# Altium project forwardConverterPCB.PrjPcb (part 6 of 22)
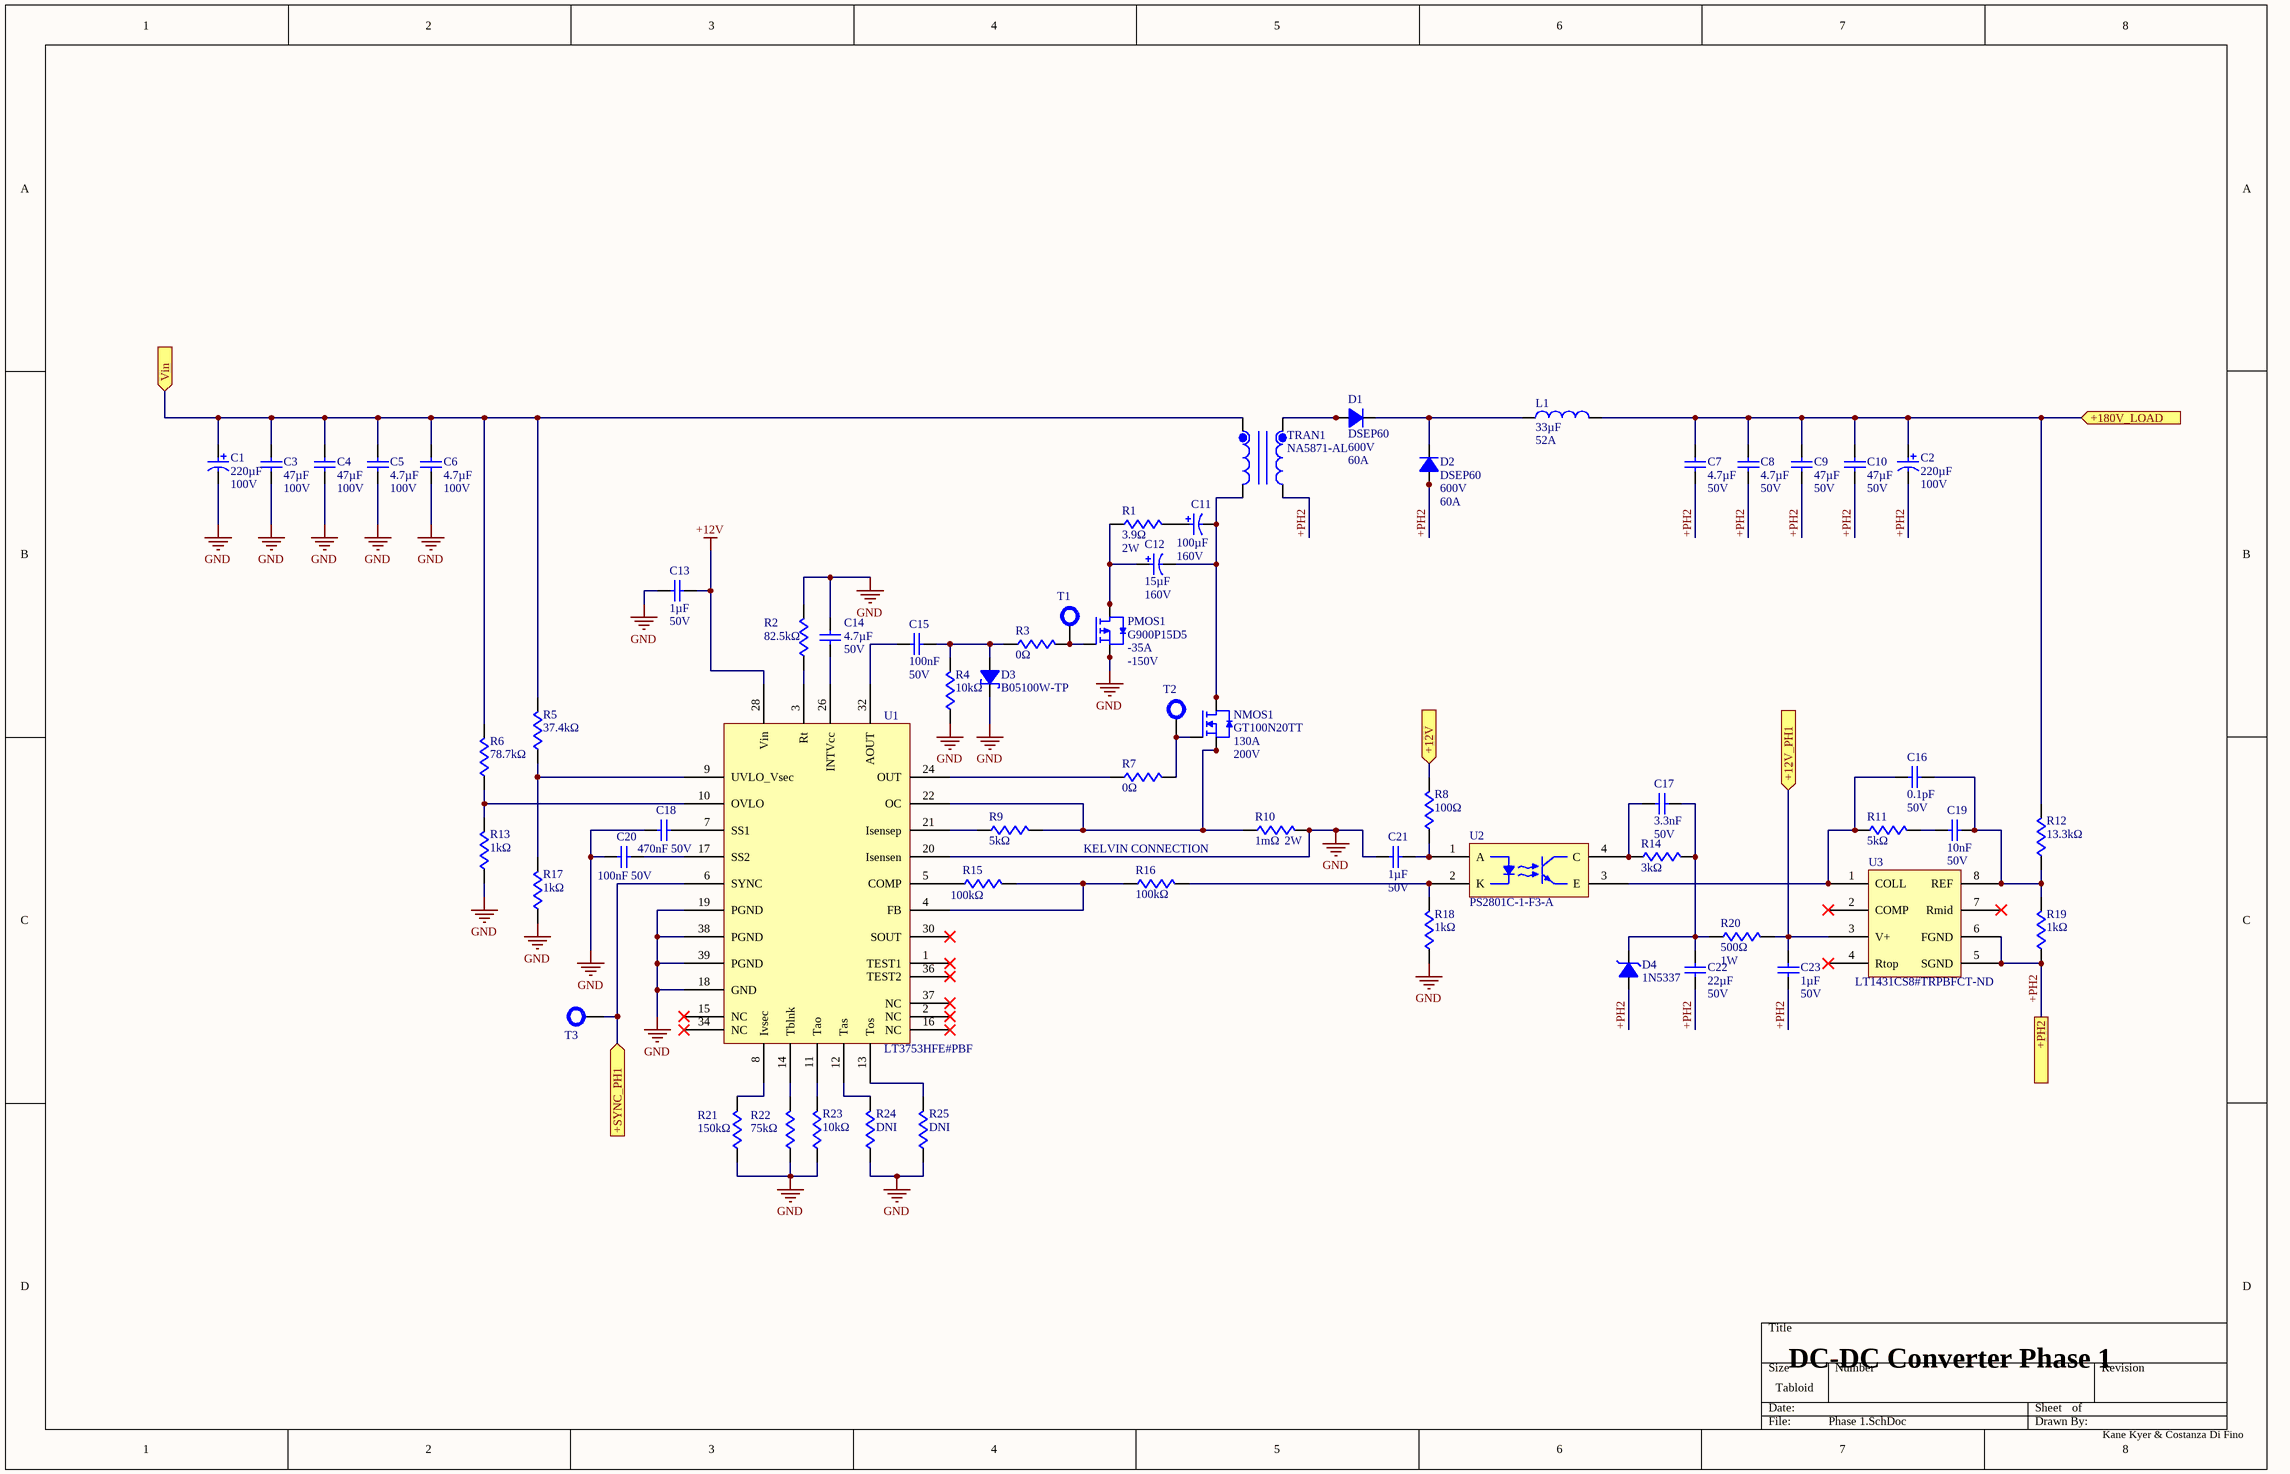
[diagram p11: Phase 1.SchDoc]

## Sheet Phase 1.SchDoc (continued)

### Library data of the parts (continued)
U2 = PS2801C-1-F3-A: Optocoupler DC-IN 1-CH Transistor DC-OUT 4-Pin SSOP T/R; Manufacturer: Renesas; Manufacturer Lifecycle Status: ACTIVE; Collector Emitter Breakdown Voltage: 80V; Collector Emitter Saturation Voltage: 300mV; Current Transfer Ratio: 50%; Dark Current: 100nA; Forward Current: 30mA; Forward Voltage: 1.4V; Input Current: 5mA; Isolation Voltage: 2.5kV; Max Power Dissipation: 120mW; Number of Elements: 1; Reverse Breakdown Voltage: 6V; Target Application: PLC\, Hybrid IC\, Power supply\, OA\, Measuring instrument\, Modem\, Communication devices; Supplier: DigiKey; RoHS: Compliant; Category: Optocouplers; Stock: 8089; Pricing: 1=0.85, 10=0.594, 100=0.436, 500=0.3653, 1000=0.34213 (USD); Case/Package: SSOP; China RoHS: Compliant; Collector Emitter Voltage (VCEO): 80V; Contact Plating: Tin Bismuth; Export Control Classification Number (ECCN) Code: EAR99; Part Family: PS2801C-1; Height: 2.1mm; Harmonized Tariff Schedule (HTS) Code: 8541.49.8000; Lifecycle Status: Production; Max Operating Temperature: 100°C; Min Operating Temperature: -55°C; MSL: 1; Mounting Technology: Surface Mount; Pins: 4; Output Voltage: 80V; Packaging: Cut Tape; REACH SVHC: Yes; ComponentLink1URL: https://datasheet.octopart.com:443/PS2801C-1-F3-A-Renesas-datasheet-179197394.pdf?src-supplier=Integrated+Device+Technology; ComponentLink1Description: https://datasheet.octopart.com:443/PS2801C-1-F3-A-Renesas-datasheet-179197394.pdf?src-supplier=Integrated+Device+Technology; ComponentLink2URL: https://datasheet.octopart.com:443/PS2801C-1-F3-A-Renesas-datasheet-150850810.pdf?src-supplier=Integrated+Device+Technology; ComponentLink2Description: https://datasheet.octopart.com:443/PS2801C-1-F3-A-Renesas-datasheet-150850810.pdf?src-supplier=Integrated+Device+Technology; ComponentLink3URL: https://datasheet.octopart.com:443/PS2801C-1-F3-A-Integrated-Device-Technology-datasheet-149188203.pdf?src-supplier=Integrated+Device+Technology; ComponentLink3Description: https://datasheet.octopart.com:443/PS2801C-1-F3-A-Integrated-Device-Technology-datasheet-149188203.pdf?src-supplier=Integrated+Device+Technology; ComponentLink4URL: https://datasheet.octopart.com:443/PS2801C-1-F3-A-Renesas-datasheet-181196928.pdf?src-supplier=IHS; ComponentLink4Description: https://datasheet.octopart.com:443/PS2801C-1-F3-A-Renesas-datasheet-181196928.pdf?src-supplier=IHS; ComponentLink5URL: https://datasheet.octopart.com:443/PS2801C-1-F3-A-NEC-datasheet-180895691.pdf?src-supplier=IHS; ComponentLink5Description: https://datasheet.octopart.com:443/PS2801C-1-F3-A-NEC-datasheet-180895691.pdf?src-supplier=IHS; ComponentLink6URL: https://datasheet.octopart.com:443/PS2801C-1-F3-A-Renesas-datasheet-138175760.pdf?src-supplier=Renesas; ComponentLink6Description: https://datasheet.octopart.com:443/PS2801C-1-F3-A-Renesas-datasheet-138175760.pdf?src-supplier=Renesas; ComponentLink7URL: https://datasheet.octopart.com:443/PS2801C-1-F3-A-Renesas-datasheet-5346041.pdf?src-supplier=element14+APAC; ComponentLink7Description: https://datasheet.octopart.com:443/PS2801C-1-F3-A-Renesas-datasheet-5346041.pdf?src-supplier=element14+APAC; ComponentLink8URL: https://datasheet.octopart.com:443/PS2801C-1-F3-A-Renesas-datasheet-136880012.pdf?src-supplier=Future+Electronics; ComponentLink8Description: https://datasheet.octopart.com:443/PS2801C-1-F3-A-Renesas-datasheet-136880012.pdf?src-supplier=Future+Electronics; ComponentLink9URL: http://sigma.octopart.com:80/reach_statement/Renesas-company-45.pdf?src-supplier=Compliance+Statements; ComponentLink9Description: http://sigma.octopart.com:80/reach_statement/Renesas-company-45.pdf?src-supplier=Compliance+Statements; ComponentLink10URL: http://sigma.octopart.com:80/conflict_mineral_statement/Renesas-company-44.pdf?src-supplier=Compliance+Statements; ComponentLink10Description: http://sigma.octopart.com:80/conflict_mineral_statement/Renesas-company-44.pdf?src-supplier=Compliance+Statements; Supplier Part Number: 559-1038-1-ND; Manufacturer Part Number: PS2801C-1-F3-A
U3 = LT1431CS8#TRPBF: V-Ref Adjustable 2.5V to 36V 100mA 8-Pin SOIC N T/R; Manufacturer: Analog Devices; Manufacturer Lifecycle Status: PRODUCTION; Cathode Current: 1mA; Reference Type: Shunt; Temperature Coefficient: 30ppm/°C; Tolerance: 0.4%; Supplier: DigiKey; Manufacturer Part Number: LT1431CS8#TRPBF; RoHS: Compliant; Category: Voltage References; Stock: 6692; Pricing: 1=4.76, 10=3.623, 25=3.3384, 100=3.025, 250=2.9682 (USD); Lead Free: Lead Free; Lifecycle Status: Production; Max Operating Temperature: 70°C; Max Output Voltage: 36V; Min Operating Temperature: 0°C; Min Output Voltage: 2.5V; Mounting Technology: Surface Mount; Pins: 8; Output Current: 100mA; Output Type: Adjustable; ComponentLink1URL: https://octopart.com:443/opatz8j6/c1?t=niELlFxzDfi0yCwovPYUCPkFv5h4fu5j3fc6Y_JWgZS-KG3gguwV1nhos1IG-X0q8FOT95_5suT6z4bIqEEHZa5Cr0Tl4wX-4Gea3le2l_P5Btni36aNB0VKN1eACfVw6XjlixpjNPZ2EoCnIZsmdjVtLb4T5dOKJqdmaG9p1s8rLUbRPnop80aw4yYD8dobzP2rtKjoPZxkMFX7s_x1MbrDISVlTufhy0OqU5fodmlGcRlmdB2uK6Q8wi9wAMnylkp3u30aJUXp9y1pTV4VT8brQ8AQsJucKiRghXvlz7QI_mNVRP68og&src-supplier=Analog+Devices; ComponentLink1Description: https://octopart.com:443/opatz8j6/c1?t=niELlFxzDfi0yCwovPYUCPkFv5h4fu5j3fc6Y_JWgZS-KG3gguwV1nhos1IG-X0q8FOT95_5suT6z4bIqEEHZa5Cr0Tl4wX-4Gea3le2l_P5Btni36aNB0VKN1eACfVw6XjlixpjNPZ2EoCnIZsmdjVtLb4T5dOKJqdmaG9p1s8rLUbRPnop80aw4yYD8dobzP2rtKjoPZxkMFX7s_x1MbrDISVlTufhy0OqU5fodmlGcRlmdB2uK6Q8wi9wAMnylkp3u30aJUXp9y1pTV4VT8brQ8AQsJucKiRghXvlz7QI_mNVRP68og&src-supplier=Analog+Devices; ComponentLink2URL: https://datasheet.octopart.com:443/LT1431CS8%23TRPBF-Analog-Devices-datasheet-158590489.pdf?src-supplier=Augswan; ComponentLink2Description: https://datasheet.octopart.com:443/LT1431CS8%23TRPBF-Analog-Devices-datasheet-158590489.pdf?src-supplier=Augswan; ComponentLink3URL: https://sigma.octopart.com:443/57689574/technical_drawing/Linear-Technology-LT1431CS8%23TRPBF.pdf?src-supplier=Linear+Technology; ComponentLink3Description: https://sigma.octopart.com:443/57689574/technical_drawing/Linear-Technology-LT1431CS8%23TRPBF.pdf?src-supplier=Linear+Technology; ComponentLink4URL: https://datasheet.octopart.com:443/LT1431CS8%23TRPBF-Linear-Technology-datasheet-12663249.pdf?src-supplier=Linear+Technology; ComponentLink4Description: https://datasheet.octopart.com:443/LT1431CS8%23TRPBF-Linear-Technology-datasheet-12663249.pdf?src-supplier=Linear+Technology; ComponentLink5URL: https://datasheet.octopart.com:443/LT1431CS8%23TRPBF-Linear-Technology-datasheet-14162000.pdf?src-supplier=iiiC; ComponentLink5Description: https://datasheet.octopart.com:443/LT1431CS8%23TRPBF-Linear-Technology-datasheet-14162000.pdf?src-supplier=iiiC; ComponentLink6URL: https://datasheet.octopart.com:443/LT1431CS8%23TRPBF-Linear-Technology-datasheet-660441.pdf?src-supplier=Component+Distributors+Inc.; ComponentLink6Description: https://datasheet.octopart.com:443/LT1431CS8%23TRPBF-Linear-Technology-datasheet-660441.pdf?src-supplier=Component+Distributors+Inc.; ComponentLink7URL: http://sigma.octopart.com:80/conflict_mineral_statement/Analog-Devices-company-33.pdf?src-supplier=Compliance+Statements; ComponentLink7Description: http://sigma.octopart.com:80/conflict_mineral_statement/Analog-Devices-company-33.pdf?src-supplier=Compliance+Statements; ComponentLink8URL: https://octopart.com:443/opatz8j6/c1?t=x_UgC8z0ZW9HVBYfWtRK1MQXyidqPpcSjAfueHo9YnawvAkFl5SvDyGxYSqo2jvWZKzVJDVTRvwyt6-9bSOmk9hm3rvBRrSJoViBsOBz-zaTqDQ1UuTon1oynDbAG1BJ8LFFGJ-pvHqqe_ahwIPaiUAyxwKDpl_WDXhLfkPwU4s3DC4oM42DqSA56VDCGnGZU0YdFavN5d4mf8bZyX9JjAzy5--p3JbOg0D6jqXi6c2GCo47z_BbYPuyEPlhjEKZPTviFMXkQtwuopNuNXSm1BD9XLOQFCoZDF8jjiZ5eNS4L1NzzTsuyw&src-supplier=Compliance+Statements; ComponentLink8Description: https://octopart.com:443/opatz8j6/c1?t=x_UgC8z0ZW9HVBYfWtRK1MQXyidqPpcSjAfueHo9YnawvAkFl5SvDyGxYSqo2jvWZKzVJDVTRvwyt6-9bSOmk9hm3rvBRrSJoViBsOBz-zaTqDQ1UuTon1oynDbAG1BJ8LFFGJ-pvHqqe_ahwIPaiUAyxwKDpl_WDXhLfkPwU4s3DC4oM42DqSA56VDCGnGZU0YdFavN5d4mf8bZyX9JjAzy5--p3JbOg0D6jqXi6c2GCo47z_BbYPuyEPlhjEKZPTviFMXkQtwuopNuNXSm1BD9XLOQFCoZDF8jjiZ5eNS4L1NzzTsuyw&src-supplier=Compliance+Statements

## Sheet Phase 2.SchDoc
size Tabloid; SheetNumber: 4; SheetTotal: 7
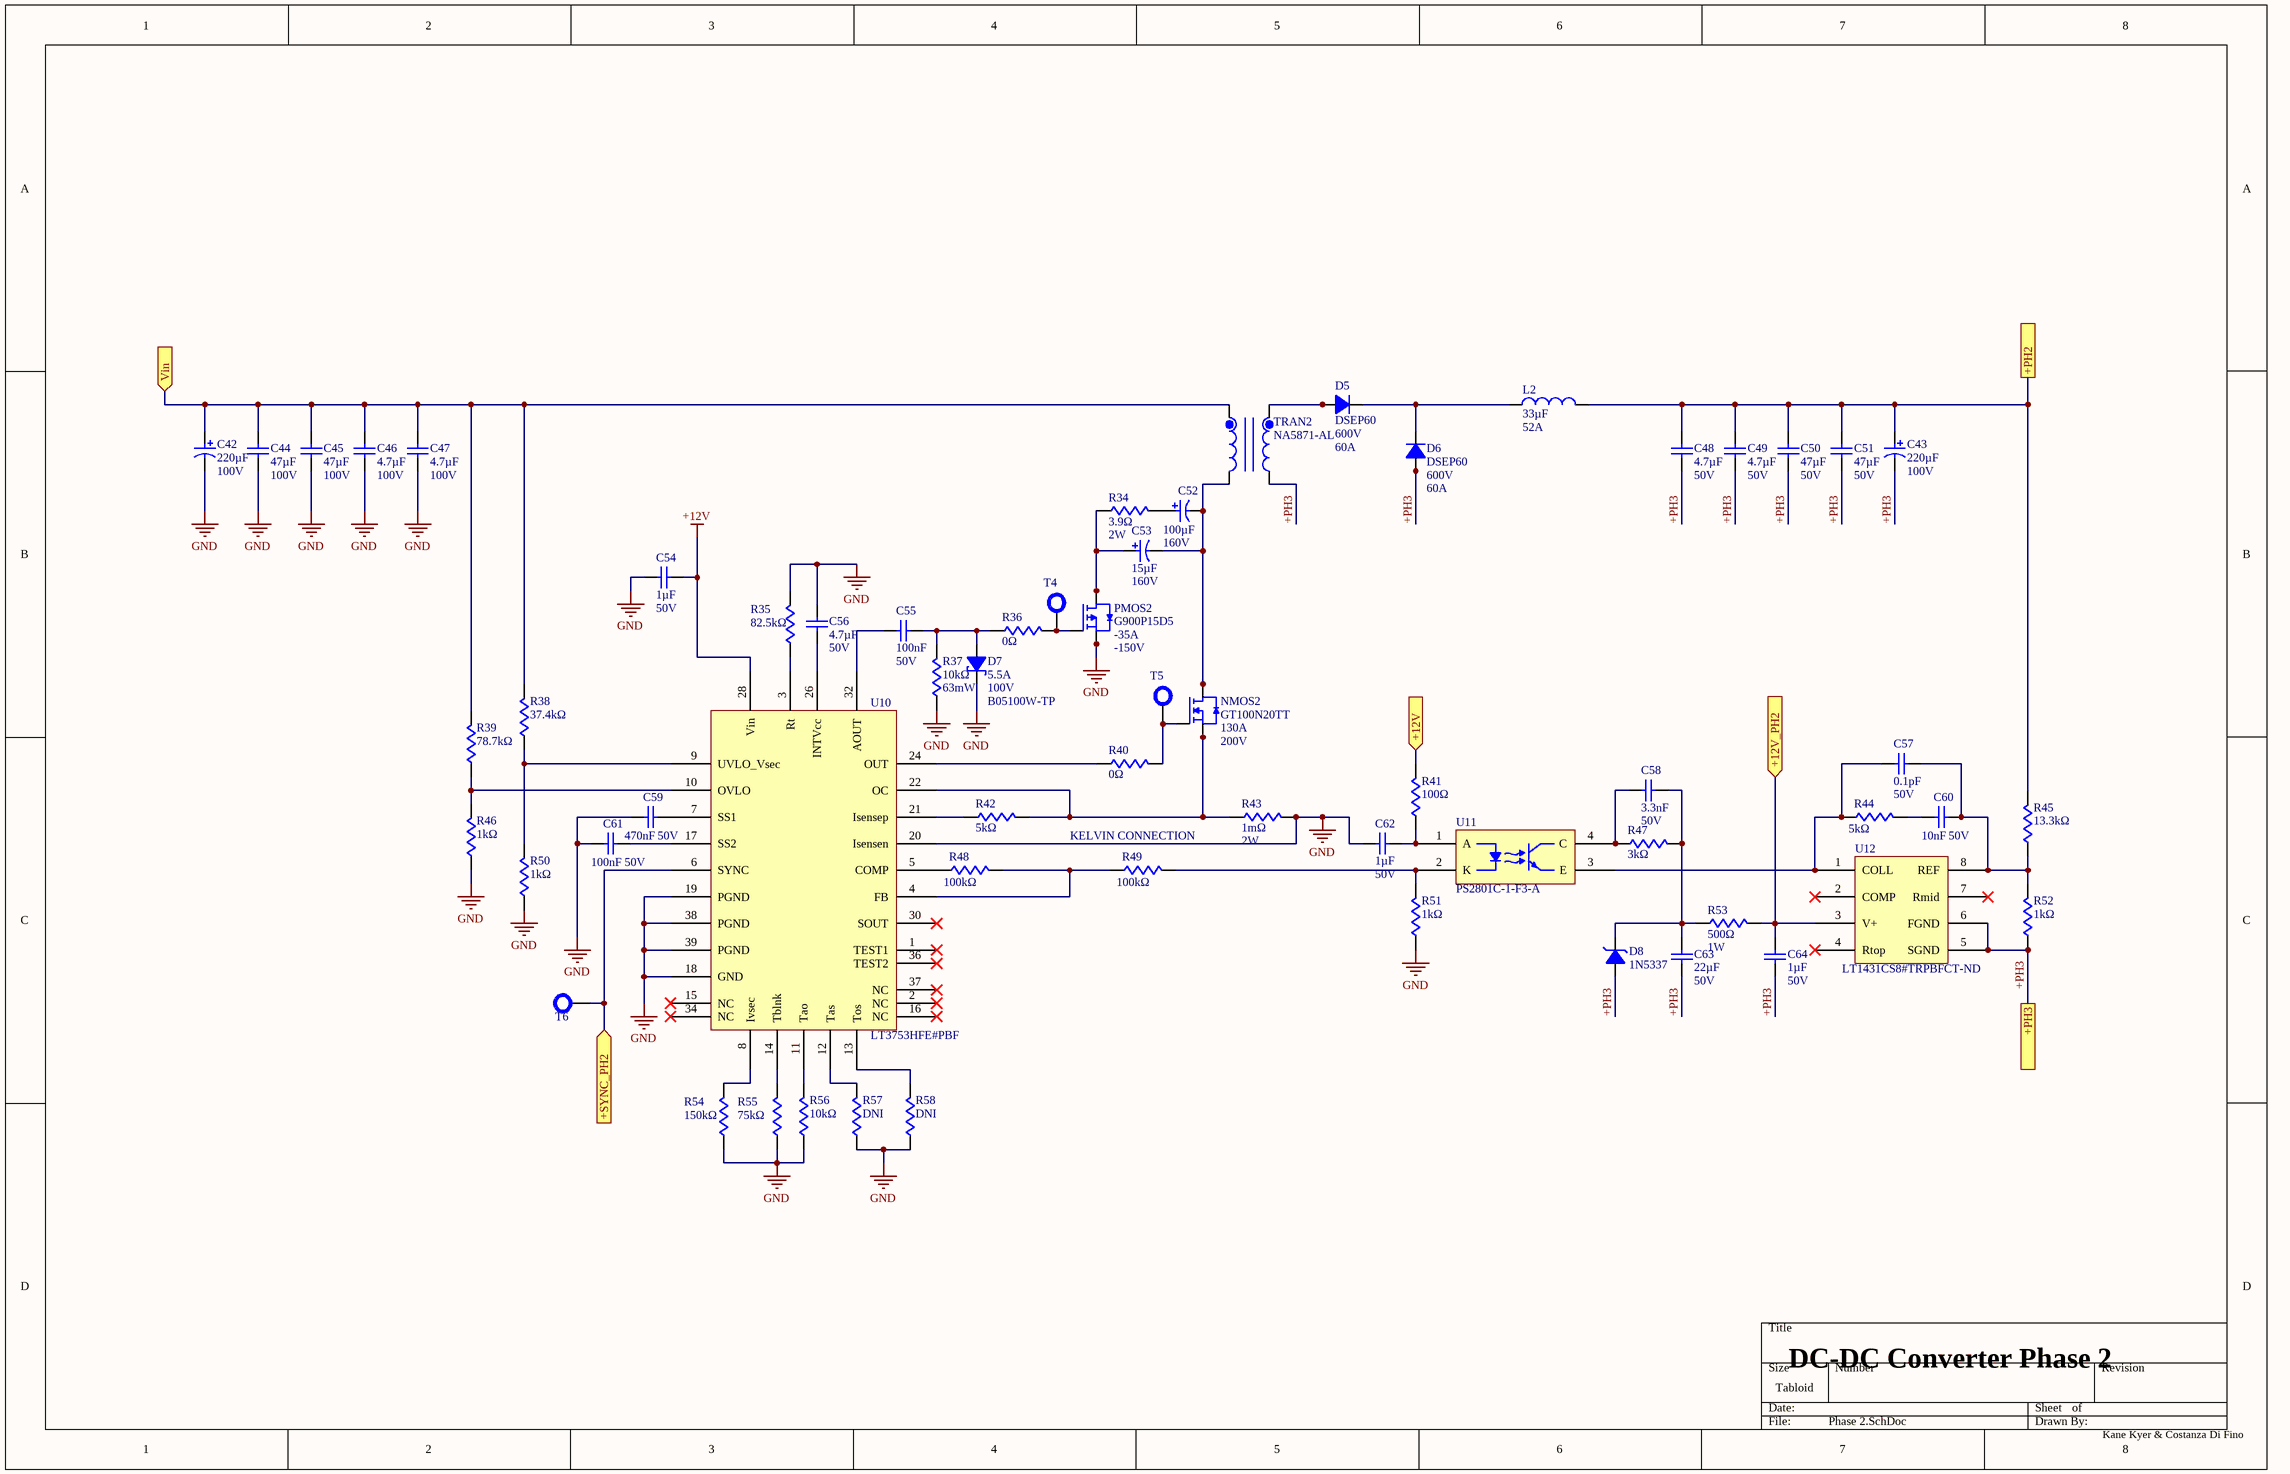
[diagram p3: Phase 2.SchDoc]

### Parts
C42  value 220µF  Voltage Rating: 100V  [C_AEC]  (hidden comment: AFK227M2AR44T-F)
C43  value 220µF  Voltage Rating: 100V  [C_AEC]  (hidden comment: AFK227M2AR44T-F)
C44  value 47µF  Voltage Rating: 100V  [C_CAA573]  (hidden comment: CAA573X7S2A476M640LH)
C45  value 47µF  Voltage Rating: 100V  [C_CAA573]  (hidden comment: CAA573X7S2A476M640LH)
C46  value 4.7µF  Voltage Rating (DC): 100V  [C_1210]  (hidden comment: GMC32X7S475K100NT)
C47  value 4.7µF  Voltage Rating (DC): 100V  [C_1210]  (hidden comment: GMC32X7S475K100NT)
C48  value 4.7µF  Voltage Rating (DC): 50V  [C_1206]  (hidden comment: GMC31X7R475K50NT)
C49  value 4.7µF  Voltage Rating (DC): 50V  [C_1206]  (hidden comment: GMC31X7R475K50NT)
C50  value 47µF  Voltage Rating (DC): 50V  [C_CKG57N]  (hidden comment: CKG57NX7R1H476M500JJ)
C51  value 47µF  Voltage Rating (DC): 50V  [C_CKG57N]  (hidden comment: CKG57NX7R1H476M500JJ)
C52  value 100µF  Voltage Rating (DC): 160V  [UUJ2C101MNJ1MS]  (hidden comment: UUJ2C101MNJ1MS)
C53  value 15µF  Voltage: 160V  [ULT2C150MNL1GS]  (hidden comment: ULT2C150MNL1GS)
C54  value 1µF  Voltage: 50V  [C_0805]  (hidden comment: CL21B105KBFNNNE)
C55  value 100nF  Voltage Rating: 50V  [C_0603]  (hidden comment: C0603C104K5RACTU)
C56  value 4.7µF  Voltage Rating (DC): 50V  [C_1206]  (hidden comment: GMC31X7R475K50NT)
C57  value 0.1pF  Voltage Rating: 50V  [C_0402]  (hidden comment: GJM1555C1HR10WB01D)
C58  value 3.3nF  Voltage Rating: 50V  [C_0603]  (hidden comment: GCM1885C1H332FA16D)
C59  value 470nF  Voltage Rating: 50V  [C_0402]  (hidden comment: GRM155R61H474KE11D)
C60  value 10nF  Voltage Rating: 50V  [C_0603]  (hidden comment: C0603C103K5RACTU)
C61  value 100nF  Voltage Rating: 50V  [C_0603]  (hidden comment: C0603C104K5RACTU)
C62  value 1µF  Voltage: 50V  [C_0805]  (hidden comment: CL21B105KBFNNNE)
C63  value 22µF  Voltage Rating (DC): 50V  [C_2220]  (hidden comment: GMC55X7R226M50NT)
C64  value 1µF  Voltage: 50V  [C_0805]  (hidden comment: CL21B105KBFNNNE)
D5  DSEP60  Vr: 600V  Io: 60A  [D_DSEP60]
D6  DSEP60  Vr: 600V  Io: 60A  [D_DSEP60]
D7  Max Forward Surge Current (Ifsm): 5.5A  Min Breakdown Voltage: 100V  [D_B05100W]  (hidden comment: B05100W-TP)
D8  Supplier Part Number: 1N5337  [D_1N5337]  (hidden comment: 1N5337BRLG)
L2  value 33µF  Irms: 52A  [CPEX4141L-330MC]  (hidden comment: CPEX4141L-330MC)
NMOS2  Id: 130A  Vds: 200V  [GT100N20TT]  (hidden comment: GT100N20TT)
PMOS2  Id: -35A  Vds: -150V  [G900P15]  (hidden comment: G900P15D5)
R34  value 3.9Ω  Power Rating: 2W  [R_SM2W]  (hidden comment: SMW23R9JT)
R35  value 82.5kΩ  [R_0805]  (hidden comment: RMCF0805FT82K5)
R36  value 0Ω  [R_0805]  (hidden comment: CRCW08050000Z0EA)
R37  value 10kΩ  Power Rating: 63mW  [R_0402]  (hidden comment: RM04F1002CT)
R38  value 37.4kΩ  [R_0603]  (hidden comment: RC0603FR-0737K4L)
R39  value 78.7kΩ  [R_0603]  (hidden comment: RC0603FR-0778K7L)
R40  value 0Ω  [R_0805]  (hidden comment: CRCW08050000Z0EA)
R41  value 100Ω  [R_0603]  (hidden comment: RC0603FR-07100RL)
R42  value 5kΩ  [R_0402]  (hidden comment: PNM0402E5001BST1)
R43  value 1mΩ  Power Rating: 2W  [R_2512]  (hidden comment: CRE2512-FZ-R001E-2)
R44  value 5kΩ  [R_0402]  (hidden comment: PNM0402E5001BST1)
R45  value 13.3kΩ  [R_0603]  (hidden comment: RMCF0603FT13K3)
R46  value 1kΩ  [R_0402]  (hidden comment: RM04F1001CT)
R47  value 3kΩ  [C_0402]  (hidden comment: AC0402FR-073KL)
R48  value 100kΩ  [R_0402]  (hidden comment: RM04F1003CT)
R49  value 100kΩ  [R_0402]  (hidden comment: RM04F1003CT)
R50  value 1kΩ  [R_0402]  (hidden comment: RM04F1001CT)
R51  value 1kΩ  [R_0402]  (hidden comment: RM04F1001CT)
R52  value 1kΩ  [R_0402]  (hidden comment: RM04F1001CT)
R53  value 500Ω  Power Rating: 1W  [R_WSC2515]  (hidden comment: WSC2515500R0FEB)
R54  value 150kΩ  [R_0603]  (hidden comment: RC0603FR-07150KL)
R55  value 75kΩ  [R_0603]  (hidden comment: AC0603FR-0775KL)
R56  value 10kΩ  [R_0402]  (hidden comment: RM04F1002CT)
R57  value DNI  [R_0805]  (hidden comment: CRCW08050000Z0EA)
R58  value DNI  [R_0805]  (hidden comment: CRCW08050000Z0EA)
T4  TEST  [TEST_POINT]  (value not drawn)
T5  TEST  [TEST_POINT]  (value not drawn)
T6  TEST  [TEST_POINT]  (value not drawn)
TRAN2  NA5871-AL  [NA5871-AL]
U10  LT3753HFE#PBF  [LT3753]
U11  PS2801C-1-F3-A  [PS2801C]
U12  Supplier Part Number: LT1431CS8#TRPBFCT-ND  [LT1431]  (hidden comment: LT1431CS8#TRPBF)

### Ports
+12V (in, see SHEET_MAP[4B], Externals[2A], Phase 1[4C], Phase 3[4C], Phase 4[4C], Phase 5[4B]), +12V_PH2 (in, see SHEET_MAP[4B], Externals[5B]), +PH2 (see SHEET_MAP[4B], Externals[4B], Phase 1[6C]), +PH3 (see SHEET_MAP[4B], Externals[4C], Phase 3[6B]), +SYNC_PH2 (in, see SHEET_MAP[4B], Externals[3C]), Vin (in, see SHEET_MAP[4B], Externals[1A], Phase 1[1B], Phase 3[1B], Phase 4[1B], Phase 5[1B])

### Nets
+12V: C54.2 R41.2 U10.28(Vin) ; port +12V
GND: C42.2 C44.1 C45.1 C46.1 C47.1 C54.1 C56.1 C59.1 C61.1 C62.1 D7.1 PMOS2.1(S) PMOS2.2(S) PMOS2.3(S) R35.2 R37.1 R43.2 R46.1 R50.1 R51.1 R54.1 R55.1 R56.1 R57.1 R58.1 U10.18(GND) U10.19(PGND) U10.20(Isensen) U10.38(PGND) U10.39(PGND)
Vin: C42.1 C44.2 C45.2 C46.2 C47.2 R38.2 R39.2 TRAN2.1 ; port Vin
+PH2: C43.1 C48.2 C49.2 C50.2 C51.2 L2.2 R45.2 ; port +PH2
+PH3: C43.2 C48.1 C49.1 C50.1 C51.1 C63.1 C64.1 D6.1(A) D6.3(A) D8.2 R52.1 TRAN2.11 U12.5(SGND) U12.6(FGND) ; port +PH3
NetC31_2: C64.2 R53.2 U12.3(V+) ; port +12V_PH2
NetC52_1: C52.1 R34.2
NetC52_2: C52.2 C53.2 NMOS2.9(D) NMOS2.10(D) NMOS2.11(D) NMOS2.12(D) NMOS2.13(D) NMOS2.14(D) NMOS2.15(D) NMOS2.16(D) TRAN2.4
NetC53_1: C53.1 PMOS2.5(D) PMOS2.6(D) PMOS2.7(D) PMOS2.8(D) R34.1
NetC55_1: C55.1 U10.32(AOUT)
NetC55_2: C55.2 D7.2 R36.1 R37.2
NetC56_2: C56.2 U10.26(INTVcc)
NetC57_1: C57.1 R44.1 U11.3(E) U12.1(COLL)
NetC57_2: C57.2 C60.2 R45.1 R52.2 U12.8(REF)
NetC58_1: C58.1 R47.1 U11.4(C)
NetC58_2: C58.2 C63.2 D8.1 R47.2 R53.1
NetC59_2: C59.2 U10.7(SS1)
NetC60_1: C60.1 R44.2
NetC61_2: C61.2 U10.17(SS2)
NetC62_2: C62.2 R41.1 U11.1(A)
NetD5_1: D5.1(A) D5.3(A) TRAN2.6
NetD5_4: D5.4(C) D6.4(C) L2.1
NetNMOS2_1: NMOS2.1(S) NMOS2.2(S) NMOS2.3(S) NMOS2.4(S) NMOS2.5(S) NMOS2.6(S) NMOS2.7(S) R42.2 R43.1 U10.22(OC)
NetNMOS2_8: NMOS2.8(G) R40.2 T5.1
NetPMOS2_4: PMOS2.4(G) R36.2 T4.1
NetR35_1: R35.1 U10.3(Rt)
NetR38_1: R38.1 R50.2 U10.9(UVLO_Vsec)
NetR39_1: R39.1 R46.2 U10.10(OVLO)
NetR40_1: R40.1 U10.24(OUT)
NetR42_1: R42.1 U10.21(Isensep)
NetR48_1: R48.1 U10.5(COMP)
NetR48_2: R48.2 R49.1 U10.4(FB)
NetR49_2: R49.2 R51.2 U11.2(K)
NetR54_2: R54.2 U10.8(Ivsec)
NetR55_2: R55.2 U10.14(Tblnk)
NetR56_2: R56.2 U10.11(Tao)
NetR57_2: R57.2 U10.12(Tas)
NetR58_2: R58.2 U10.13(Tos)
NetT6_1: T6.1 U10.6(SYNC) ; port +SYNC_PH2

Not connected (* = marked no-connect by the designer): U10 1(TEST1)* 2(NC)* 15(NC)* 16(NC)* 30(SOUT)* 34(NC)* 36(TEST2)* 37(NC)*; U12 2(COMP)* 4(Rtop)* 7(Rmid)*

### Notes on the sheet
- (near R49) KELVIN CONNECTION
- DC-DC Converter Phase 2
- Kane Kyer & Costanza Di Fino